# EAGLE schematic Schematic1 (EAGLE 9.3.0)
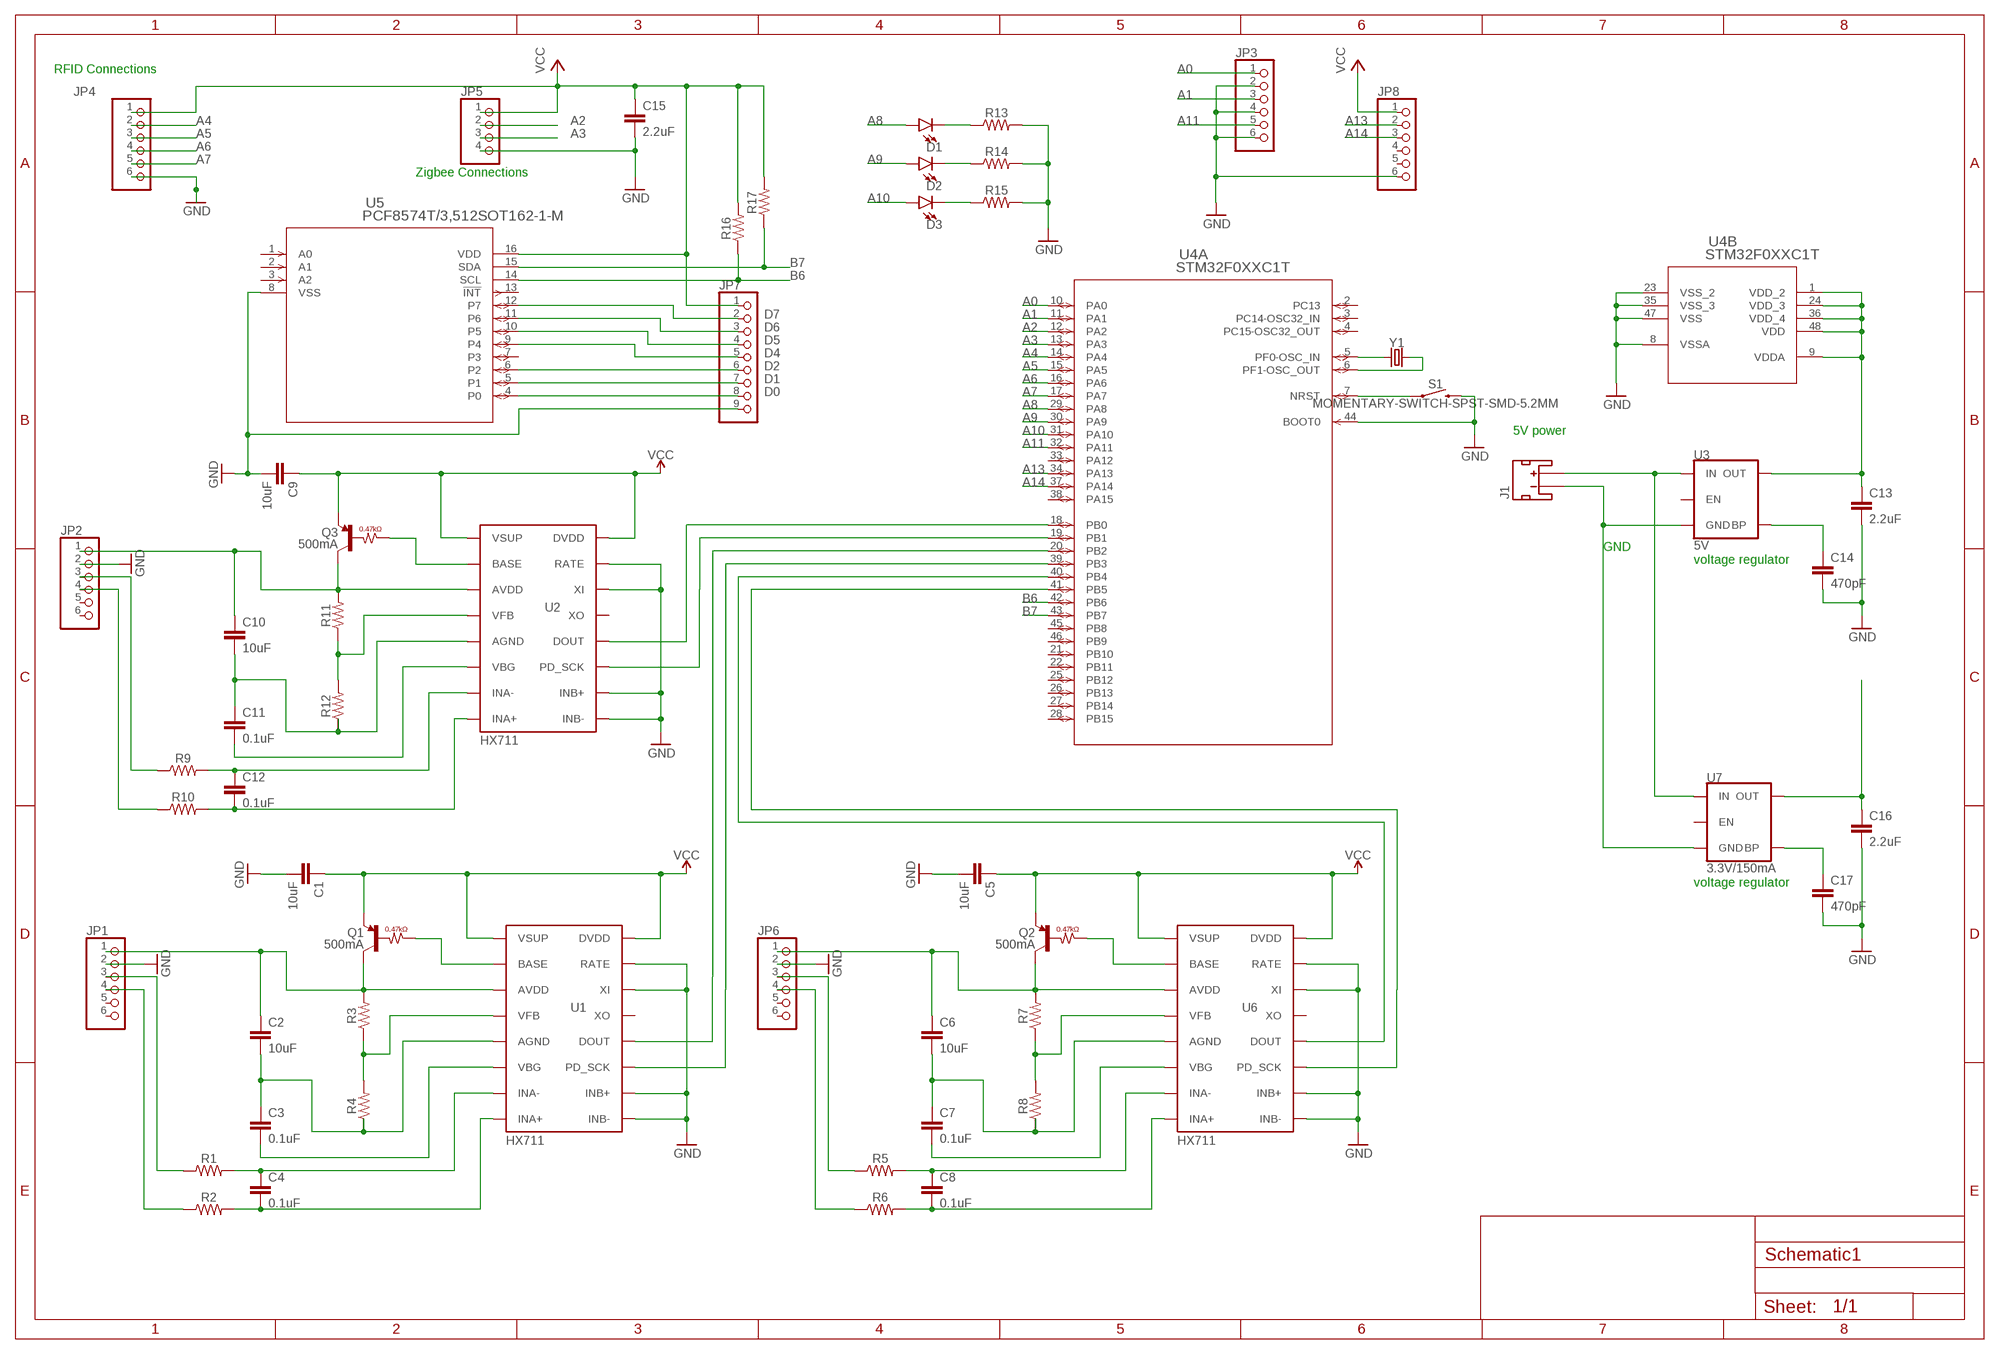
[diagram p0: schematic, sheet 1]

## Parts
C1  10uF  10UF-0603-6.3V-20%  [0603]
C2  10uF  10UF-0603-6.3V-20%  [0603]
C3  0.1uF  0.1UF-0603-25V-(+80/-20%)  [0603]
C4  0.1uF  0.1UF-0603-25V-(+80/-20%)  [0603]
C5  10uF  10UF-0603-6.3V-20%  [0603]
C6  10uF  10UF-0603-6.3V-20%  [0603]
C7  0.1uF  0.1UF-0603-25V-(+80/-20%)  [0603]
C8  0.1uF  0.1UF-0603-25V-(+80/-20%)  [0603]
C9  10uF  10UF-0603-6.3V-20%  [0603]
C10  10uF  10UF-0603-6.3V-20%  [0603]
C11  0.1uF  0.1UF-0603-25V-(+80/-20%)  [0603]
C12  0.1uF  0.1UF-0603-25V-(+80/-20%)  [0603]
C13  2.2uF  2.2UF-0603-10V-20%  [0603]
C14  470pF  470PF-0603-50V-5%  [0603]
C15  2.2uF  2.2UF-0603-10V-20%  [0603]
C16  2.2uF  2.2UF-0603-10V-20%  [0603]
C17  470pF  470PF-0603-50V-5%  [0603]
D1  LED5MM  [LED_5MM]
D2  LED5MM  [LED_5MM]
D3  LED5MM  [LED_5MM]
J1  JST_2MM_MALE  [JST-2-SMD]
JP1  PINHD-1X6  [1X06]
JP2  PINHD-1X6  [1X06]
JP3  PINHD-1X6  [1X06]
JP4  PINHD-1X6  [1X06]
JP5  PINHD-1X4  [1X04]
JP6  PINHD-1X6  [1X06]
JP7  PINHD-1X9  [1X09]
JP8  PINHD-1X6  [1X06]
Q1  500mA  TRANS_PNP_RES-DDTB142TC  [SOT23-3]
Q2  500mA  TRANS_PNP_RES-DDTB142TC  [SOT23-3]
Q3  500mA  TRANS_PNP_RES-DDTB142TC  [SOT23-3]
R1  RESISTOR0603  [0603]
R2  RESISTOR0603  [0603]
R3  RESISTOR0603  [0603]
R4  RESISTOR0603  [0603]
R5  RESISTOR0603  [0603]
R6  RESISTOR0603  [0603]
R7  RESISTOR0603  [0603]
R8  RESISTOR0603  [0603]
R9  RESISTOR0603  [0603]
R10  RESISTOR0603  [0603]
R11  RESISTOR0603  [0603]
R12  RESISTOR0603  [0603]
R13  RESISTOR0603  [0603]
R14  RESISTOR0603  [0603]
R15  RESISTOR0603  [0603]
R16  RESISTOR0603  [0603]
R17  RESISTOR0603  [0603]
S1  MOMENTARY-SWITCH-SPST-SMD-5.2MM  [TACTILE_SWITCH_SMD_5.2MM]
U1  HX711  [SO16]
U2  HX711  [SO16]
U3  5V  V_REG_MIC52055V  [SOT23-5]
U4  STM32F0XXC1T  [LQFP48-7X7MM]
U5  PCF8574T/3,512SOT162-1-M  [SOT162-1-M]
U6  HX711  [SO16]
U7  3.3V/150mA  V_REG_MIC52053.3V  [SOT23-5]
Y1  CRYSTALPTH-HC49US  [HC49US]

## Nets
A0: JP3.1 U4.10(A:PA0)
A1: JP3.3 U4.11(A:PA1)
A2: JP5.2 U4.12(A:PA2)
A3: JP5.3 U4.13(A:PA3)
A4: JP4.2 U4.14(A:PA4)
A5: JP4.3 U4.15(A:PA5)
A6: JP4.4 U4.16(A:PA6)
A7: JP4.5 U4.17(A:PA7)
A8: D1.A U4.29(A:PA8)
A9: D2.A U4.30(A:PA9)
A10: D3.A U4.31(A:PA10)
A11: JP3.5 U4.32(A:PA11)
A13: JP8.2 U4.34(A:PA13)
A14: JP8.3 U4.37(A:PA14)
B6: R16.1 U4.42(A:PB6) U5.14(SCL)
B7: R17.1 U4.43(A:PB7) U5.15(SDA)
D0: JP7.8 U5.4(P0)
D1: JP7.7 U5.5(P1)
D2: JP7.6 U5.6(P2)
D4: JP7.5 U5.9(P4)
D5: JP7.4 U5.10(P5)
D6: JP7.3 U5.11(P6)
D7: JP7.2 U5.12(P7)
GND: C1.2 C5.2 C9.2 C13.2 C14.2 C15.2 C16.2 C17.2 JP1.2 JP2.2 JP3.2 JP3.4 JP3.6 JP4.6 JP5.4 JP6.2 JP7.9 JP8.6 R13.2 R14.2 R15.2 S1.3 U1.9(INB-) U1.10(INB+) U1.14(XI) U1.15(RATE) U2.9(INB-) U2.10(INB+) U2.14(XI) U2.15(RATE) U4.8(B:VSSA) U4.23(B:VSS_2) U4.35(B:VSS_3) U4.44(A:BOOT0) U4.47(B:VSS) U5.8(VSS) U6.9(INB-) U6.10(INB+) U6.14(XI) U6.15(RATE)
N$2: JP1.3 R1.1
N$3: JP1.4 R2.1
N$4: C4.1 R1.2 U1.7(INA-)
N$5: C4.2 R2.2 U1.8(INA+)
N$6: Q1.1(B) U1.2(BASE)
N$7: C2.1 JP1.1 Q1.3(C) R3.2 U1.3(AVDD)
N$8: C2.2 C3.1 R4.1 U1.5(AGND)
N$9: R3.1 R4.2 U1.4(VFB)
N$10: S1.1 U4.7(A:NRST)
N$11: C3.2 U1.6(VBG)
N$12: JP6.3 R5.1
N$13: JP6.4 R6.1
N$14: C8.1 R5.2 U6.7(INA-)
N$15: C8.2 R6.2 U6.8(INA+)
N$16: Q2.1(B) U6.2(BASE)
N$17: C6.1 JP6.1 Q2.3(C) R7.2 U6.3(AVDD)
N$18: C6.2 C7.1 R8.1 U6.5(AGND)
N$19: R7.1 R8.2 U6.4(VFB)
N$20: C7.2 U6.6(VBG)
N$21: U4.5(A:PF0-OSC_IN) Y1.1
N$22: U4.6(A:PF1-OSC_OUT) Y1.2
N$23: JP2.3 R9.1
N$24: JP2.4 R10.1
N$25: C12.1 R9.2 U2.7(INA-)
N$26: C12.2 R10.2 U2.8(INA+)
N$27: Q3.1(B) U2.2(BASE)
N$28: C10.1 JP2.1 Q3.3(C) R11.2 U2.3(AVDD)
N$29: C10.2 C11.1 R12.1 U2.5(AGND)
N$30: R11.1 R12.2 U2.4(VFB)
N$31: C11.2 U2.6(VBG)
N$32: J1.1(-) U3.2(GND) U7.2(GND)
N$33: C16.1 U7.5(OUT)
N$34: C17.1 U7.4(BP)
N$36: C13.1 U3.5(OUT) U4.1(B:VDD_2) U4.9(B:VDDA) U4.24(B:VDD_3) U4.36(B:VDD_4) U4.48(B:VDD)
N$37: C14.1 U3.4(BP)
N$38: J1.2(+) U3.1(IN) U7.1(IN)
N$39: D1.K(C) R13.1
N$41: D2.K(C) R14.1
N$42: D3.K(C) R15.1
N$54: U4.41(A:PB5) U6.11(PD_SCK)
N$55: U4.40(A:PB4) U6.12(DOUT)
N$56: U1.11(PD_SCK) U4.39(A:PB3)
N$57: U1.12(DOUT) U4.20(A:PB2)
N$58: U2.11(PD_SCK) U4.19(A:PB1)
N$59: U2.12(DOUT) U4.18(A:PB0)
VCC: C1.1 C5.1 C9.1 C15.1 JP4.1 JP5.1 JP7.1 JP8.1 Q1.2(E) Q2.2(E) Q3.2(E) R16.2 R17.2 U1.1(VSUP) U1.16(DVDD) U2.1(VSUP) U2.16(DVDD) U5.16(VDD) U6.1(VSUP) U6.16(DVDD)
Unconnected: J1.NC1(PAD1) J1.NC2(PAD2) JP1.5 JP1.6 JP2.5 JP2.6 JP6.5 JP6.6 JP8.4 JP8.5 U1.13(XO) U2.13(XO) U3.3(EN) U4.2(A:PC13) U4.3(A:PC14-OSC32_IN) U4.4(A:PC15-OSC32_OUT) U4.21(A:PB10) U4.22(A:PB11) U4.25(A:PB12) U4.26(A:PB13) U4.27(A:PB14) U4.28(A:PB15) U4.33(A:PA12) U4.38(A:PA15) U4.45(A:PB8) U4.46(A:PB9) U5.1(A0) U5.2(A1) U5.3(A2) U5.7(P3) U5.13(!INT) U6.13(XO) U7.3(EN)

## Notes on the sheet
- RFID Connections
- Zigbee Connections
- 5V power
- GND
- voltage regulator
- voltage regulator

## Library data of the parts
C1 C2 C5 C6 C9 C10 = SparkFun-Capacitors:10UF: 10.0µF ceramic capacitors A capacitor is a passive two-terminal electrical component used to store electrical energy temporarily in an electric field.; PROD_ID: CAP-11015
C3 C4 C7 C8 C11 C12 = SparkFun-Capacitors:0.1UF: 0.1µF ceramic capacitors A capacitor is a passive two-terminal electrical component used to store electrical energy temporarily in an electric field.; PROD_ID: CAP-00810
C13 C15 C16 = SparkFun-Capacitors:2.2UF: 2.2µF ceramic capacitors A capacitor is a passive two-terminal electrical component used to store electrical energy temporarily in an electric field.; PROD_ID: CAP-07888
C14 C17 = SparkFun-Capacitors:470PF: 470pF ceramic capacitors A capacitor is a passive two-terminal electrical component used to store electrical energy temporarily in an electric field.; PROD_ID: CAP-07884
D1-D3 = SparkFun-LED:LED: LED (Generic) Standard schematic elements and footprints for 5mm, 3mm, 1206, and 0603 sized LEDs. Generic LEDs with no color specified.
J1 = SparkFun-Connectors:JST_2MM_MALE: JST 2MM MALE RA CONNECTOR Two pin, compact surface mount connector. Commonly used as a battery input connection point. We really like the solid locking feeling and high current rating on these small connectors. We use these all the time as battery connectors. Mates to single-cell LiPo batteries. Here is the connector we sell at SparkFun: JST Right Angle Connector - White <https://www.sparkfun.com/products/8612> (PRT-08612) Datasheet <http://www.sparkfun.com/datasheets/Prototyping/Connectors/JST-Horizontal.pdf> It was used on these SparkFun products: SparkFun MOSFET Power Controller <https://www.sparkfun.com/products/11214> (PRT-11214) SparkFun Battery Babysitter - LiPo Battery Manager <https://www.sparkfun.com/products/13777> (PRT-13777) And many, many others that required a lipo battery connection.; PROD_ID: CONN-11443; SF_ID: PRT-08612
JP1-JP4 JP6 JP8 = pinhead:PINHD-1X6: PIN HEADER
JP5 = pinhead:PINHD-1X4: PIN HEADER
JP7 = pinhead:PINHD-1X9: PIN HEADER
Q1-Q3 = SparkFun-DiscreteSemi:TRANS_PNP_RES: PNP transistor with built in base resistor Current controlled device with built in current control for tighter layouts. Link to datasheet <http://www.diodes.com/_files/datasheets/ds30403.pdf>. SparkFun Products: SparkFun OpenSegment Serial Display - White <https://www.sparkfun.com/products/11644> SparkFun OpenSegment Serial Display - Red <https://www.sparkfun.com/products/11644>; PROD_ID: TRANS-11479
R1-R17 = SparkFun-Resistors:RESISTOR: Generic Resistor Package
S1 = SparkFun-Switches:MOMENTARY-SWITCH-SPST: Momentary Switch (Pushbutton) - SPST Normally-open (NO) SPST momentary switches (buttons, pushbuttons). Variants PTH-12MM - 12mm square, through-hole Momentary Pushbutton Switch - 12mm Square <https://www.sparkfun.com/products/9190> (COM-09190) PTH-6.0MM, PTH-6.0MM-KIT - 6.0mm square, through-hole Mini Pushbutton Switch <https://www.sparkfun.com/products/97> (COM-00097) KIT package intended for soldering kit's - only one side of pads' copper is exposed. PTH-RIGHT-ANGLE-KIT - Right-angle, through-hole Right Angle Tactile Button <https://www.sparkfun.com/products/10791> - Used on SparkFun BigTime Watch Kit <https://www.sparkfun.com/products/11734> SMD-12MM - 12mm square, surface-mount Tactile Button - SMD (12mm) <https://www.sparkfun.com/products/12993> (COM-12993) Used on SparkFun PicoBoard <https://www.sparkfun.com/products/11888> SMD-4.5MM - 4.5mm Square Trackball Switch Used on SparkFun Blackberry Trackballer Breakout <https://www.sparkfun.com/products/13169> SMD-4.6MMX2.8MM - 4.60mm x 2.80mm, surface mount Used on SparkFun SAMD21 Mini Breakout <https://www.sparkfun.com/products/13664> SMD-5.2MM, SMD-5.2-REDUNDANT - 5.2mm square, surface-mount Mini Pushbutton Switch - SMD <https://www.sparkfun.com/products/8720> (COM-08720) Used on Arduino Pro Mini <https://www.sparkfun.com/products/11114> REDUNDANT package connects both switch circuits together SMD-6.0X3.5MM - 6.0 x 3.5mm, surface mount Momentary Reset Switch SMD <https://www.sparkfun.com/products/8229> (COM-08229) SMD-6.2MM-TALL - 6.2mm square, surface mount Tactile Button - SMD (6mm) <https://www.sparkfun.com/products/12992> Used on SparkFun Digital Sandbox <https://www.sparkfun.com/products/12651> SMD-RIGHT-ANGLE - Right-angle, surface mount Used on SparkFun Block for Intel® Edison - Arduino <https://www.sparkfun.com/products/13036>; PROD_ID: SWCH-08247; SF_SKU: COM-08720
U1 U2 U6 = SparkFun-IC-Conversion:HX711: AVIA Semiconductor HX711 - ADC 24-Bit Analog-to-Digital Converter for Weigh Scales Datasheet <https://cdn.sparkfun.com/datasheets/Sensors/ForceFlex/hx711_english.pdf> SparkFun Products: SparkFun Load Cell Amplifier - HX711 <https://www.sparkfun.com/products/13879>; PROD_ID: IC-12445
U3 = SparkFun-IC-Power:V_REG_MIC5205: V_REG MIC5205 Standard 3.3V, 5V, and Adjustable 150mA LDO voltage regulator in SOT-23 layout. Micrel part MIC5205. BP (by-pass) pin is used to lower output noise with 470pF cap, may be left open. On the adjustable version BP is used to set output.; PROD_ID: VREG-00823
U4 = ECE477_Resources:STM32F0XXC1T; MANUFACTURER_PART_NUMBER: stm32f0xxc1t; VENDOR: STMicroelectronics
U5 = ECE477_Resources:PCF8574T/3,512; MANUFACTURER_PART_NUMBER: PCF8574T3512; VENDOR: NXP
U7 = SparkFun-IC-Power:V_REG_MIC5205: V_REG MIC5205 Standard 3.3V, 5V, and Adjustable 150mA LDO voltage regulator in SOT-23 layout. Micrel part MIC5205. BP (by-pass) pin is used to lower output noise with 470pF cap, may be left open. On the adjustable version BP is used to set output.; PROD_ID: VREG-00822
Y1 = SparkFun-Clocks:CRYSTAL: Crystals (Generic) These are passive quartz crystals, which can be used as a clock source for a microcontroller. Crystal's are two-terminal devices. They require external "load" capacitors to generate an oscillating signal.